# EAGLE schematic MicroBoardMk1 (EAGLE 7.2.0)

## Sheet 1 of 4
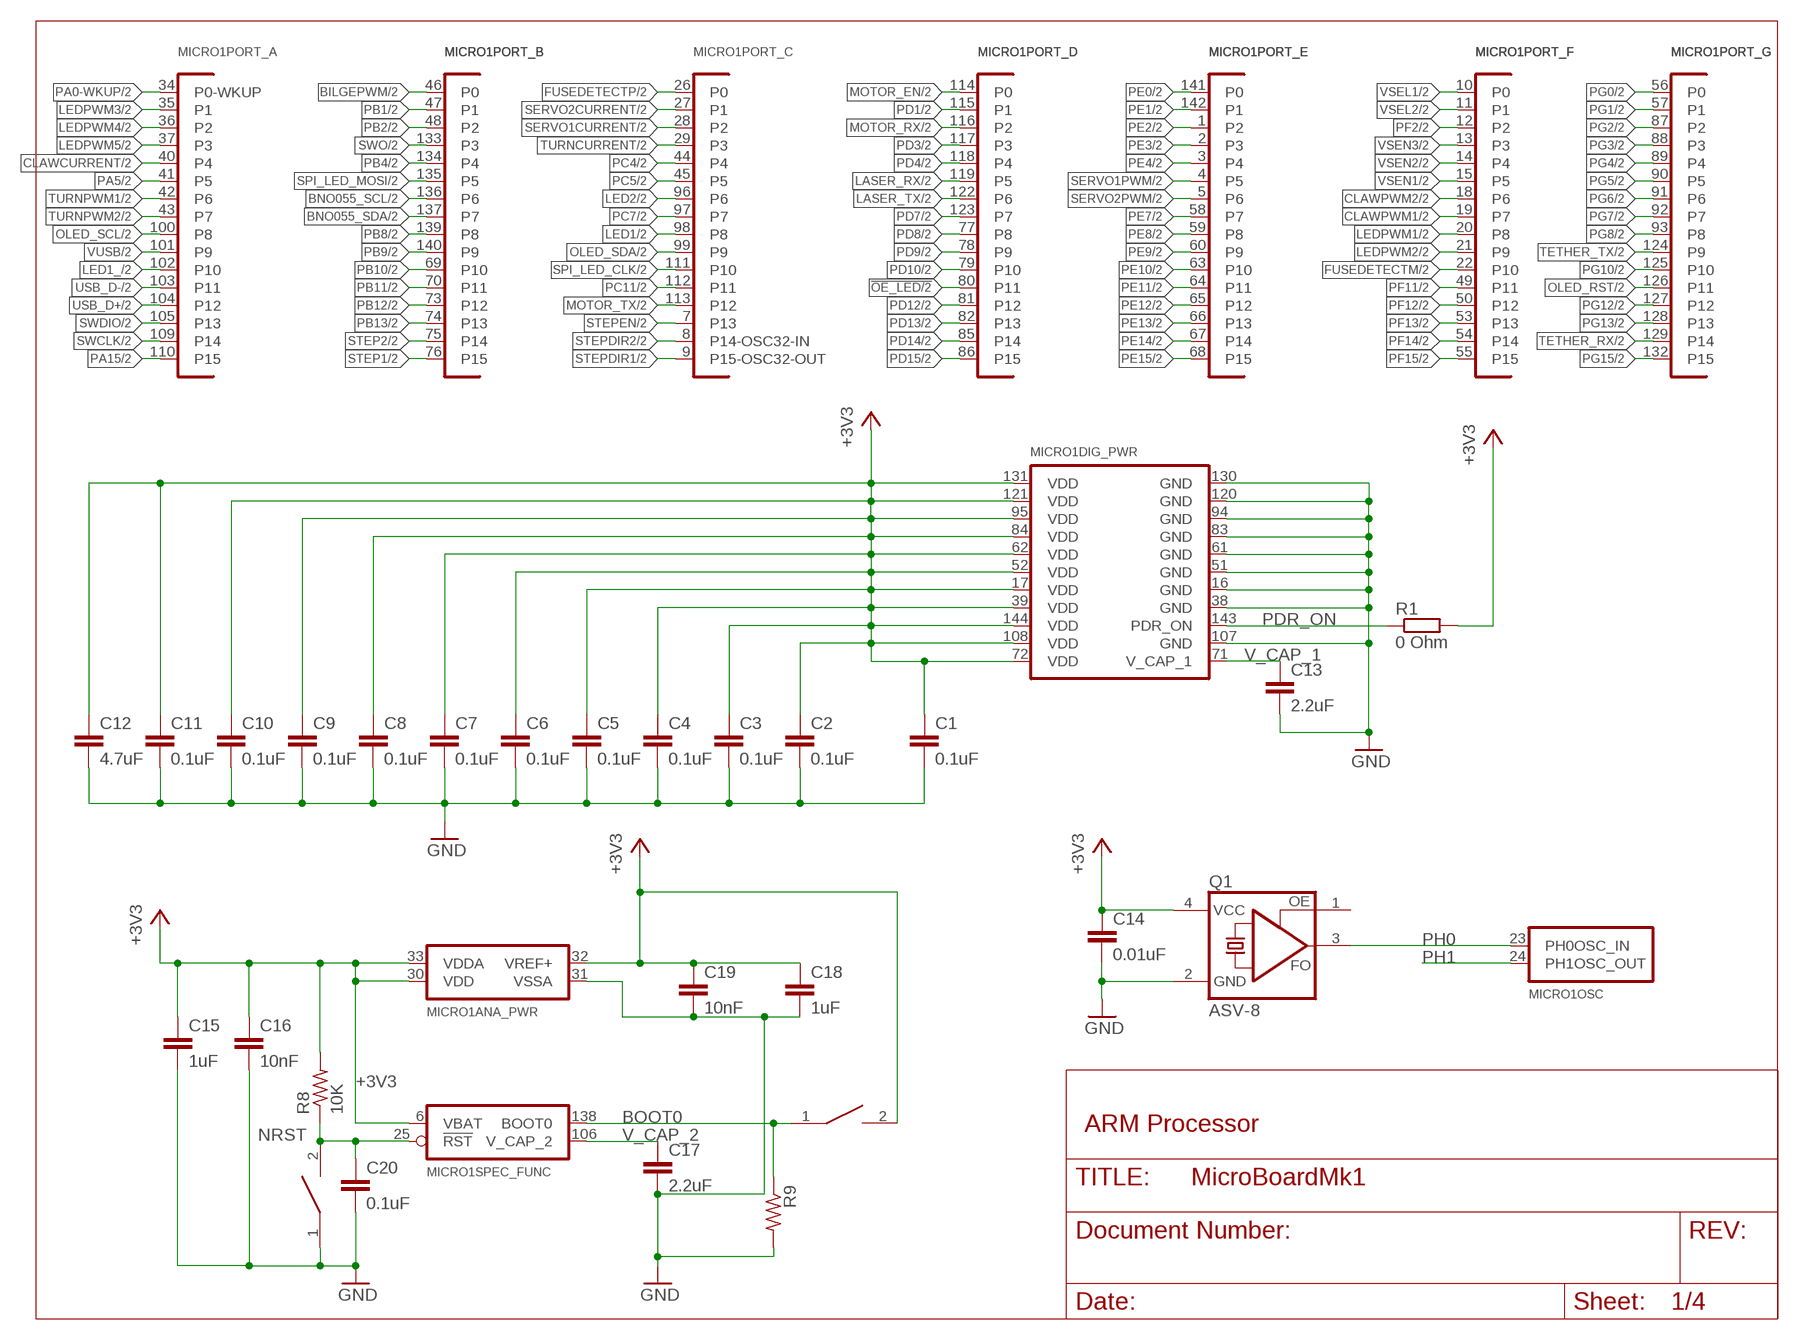
[diagram p0: schematic, sheet 1]

### Parts
BOOT_SW  SWITCH  [SW_2512]
C1  0.1uF  C-EUC0603  [C0603]
C2  0.1uF  C-EUC0603  [C0603]
C3  0.1uF  C-EUC0603  [C0603]
C4  0.1uF  C-EUC0603  [C0603]
C5  0.1uF  C-EUC0603  [C0603]
C6  0.1uF  C-EUC0603  [C0603]
C7  0.1uF  C-EUC0603  [C0603]
C8  0.1uF  C-EUC0603  [C0603]
C9  0.1uF  C-EUC0603  [C0603]
C10  0.1uF  C-EUC0603  [C0603]
C11  0.1uF  C-EUC0603  [C0603]
C12  4.7uF  C-EUC0603  [C0603]
C13  2.2uF  C-EUC0603  [C0603]
C14  0.01uF  C-EUC0603  [C0603]
C15  1uF  C-EUC0603  [C0603]
C16  10nF  C-EUC0603  [C0603]
C17  2.2uF  C-EUC0603  [C0603]
C18  1uF  C-EUC0603  [C0603]
C19  10nF  C-EUC0603  [C0603]
C20  0.1uF  C-EUC0603  [C0603]
MICRO1  STM32F407ZET6  [SQFP-S-20X20-144]
Q1  ASV-8  ASF  [ASF]
R1  0 Ohm  R-EU_R0603  [R0603]
R8  10K  R-US_R0603  [R0603]
R9  R-US_R0603  [R0603]
RST_SW  SWITCH  [SW_2512]

### Nets
!OE_LED: MICRO1.80(PORT_D:P11) ; also sheet 2,4
+3V3: BOOT_SW.2 C1.1 C2.1 C3.1 C4.1 C5.1 C6.1 C7.1 C8.1 C9.1 C10.1 C11.1 C12.1 C14.1 C15.1 C16.1 C18.1 C19.1 MICRO1.6(SPEC_FUNC:VBAT) MICRO1.17(DIG_PWR:VDD) MICRO1.30(ANA_PWR:VDD) MICRO1.32(ANA_PWR:VREF+) MICRO1.33(ANA_PWR:VDDA) MICRO1.39(DIG_PWR:VDD) MICRO1.52(DIG_PWR:VDD) MICRO1.62(DIG_PWR:VDD) MICRO1.72(DIG_PWR:VDD) MICRO1.84(DIG_PWR:VDD) MICRO1.95(DIG_PWR:VDD) MICRO1.108(DIG_PWR:VDD) MICRO1.121(DIG_PWR:VDD) MICRO1.131(DIG_PWR:VDD) MICRO1.144(DIG_PWR:VDD) Q1.4(VCC) R1.2 R8.2 ; also sheet 2,3,4
BILGEPWM: MICRO1.46(PORT_B:P0) ; also sheet 2
BNO055_SCL: MICRO1.136(PORT_B:P6) ; also sheet 2,3
BNO055_SDA: MICRO1.137(PORT_B:P7) ; also sheet 2,3
BOOT0: BOOT_SW.1 MICRO1.138(SPEC_FUNC:BOOT0) R9.1 ; also sheet 2
CLAWCURRENT: MICRO1.40(PORT_A:P4) ; also sheet 2
CLAWPWM1: MICRO1.19(PORT_F:P7) ; also sheet 2
CLAWPWM2: MICRO1.18(PORT_F:P6) ; also sheet 2
FUSEDETECTM: MICRO1.22(PORT_F:P10) ; also sheet 2
FUSEDETECTP: MICRO1.26(PORT_C:P0) ; also sheet 2
GND: C1.2 C2.2 C3.2 C4.2 C5.2 C6.2 C7.2 C8.2 C9.2 C10.2 C11.2 C12.2 C13.2 C14.2 C15.2 C16.2 C17.2 C18.2 C19.2 C20.2 MICRO1.16(DIG_PWR:GND) MICRO1.31(ANA_PWR:VSSA) MICRO1.38(DIG_PWR:GND) MICRO1.51(DIG_PWR:GND) MICRO1.61(DIG_PWR:GND) MICRO1.83(DIG_PWR:GND) MICRO1.94(DIG_PWR:GND) MICRO1.107(DIG_PWR:GND) MICRO1.120(DIG_PWR:GND) MICRO1.130(DIG_PWR:GND) Q1.2(GND) R9.2 RST_SW.1 ; also sheet 2,3,4
LASER_RX: MICRO1.119(PORT_D:P5) ; also sheet 2
LASER_TX: MICRO1.122(PORT_D:P6) ; also sheet 2
LED1: MICRO1.98(PORT_C:P8) ; also sheet 2,4
LED1_: MICRO1.102(PORT_A:P10) ; also sheet 2
LED2: MICRO1.96(PORT_C:P6) ; also sheet 2,4
LEDPWM1: MICRO1.20(PORT_F:P8) ; also sheet 2
LEDPWM2: MICRO1.21(PORT_F:P9) ; also sheet 2
LEDPWM3: MICRO1.35(PORT_A:P1) ; also sheet 2
LEDPWM4: MICRO1.36(PORT_A:P2) ; also sheet 2
LEDPWM5: MICRO1.37(PORT_A:P3) ; also sheet 2
MOTOR_EN: MICRO1.114(PORT_D:P0) ; also sheet 2,4
MOTOR_RX: MICRO1.116(PORT_D:P2) ; also sheet 2,4
MOTOR_TX: MICRO1.113(PORT_C:P12) ; also sheet 2,4
NRST: C20.1 MICRO1.25(SPEC_FUNC:!RST) R8.1 RST_SW.2 ; also sheet 2
OLED_RST: MICRO1.126(PORT_G:P11) ; also sheet 2
OLED_SCL: MICRO1.100(PORT_A:P8) ; also sheet 2
OLED_SDA: MICRO1.99(PORT_C:P9) ; also sheet 2
PA0-WKUP: MICRO1.34(PORT_A:P0-WKUP) ; also sheet 2
PA5: MICRO1.41(PORT_A:P5) ; also sheet 2
PA15: MICRO1.110(PORT_A:P15) ; also sheet 2
PB1: MICRO1.47(PORT_B:P1) ; also sheet 2
PB2: MICRO1.48(PORT_B:P2) ; also sheet 2
PB4: MICRO1.134(PORT_B:P4) ; also sheet 2
PB8: MICRO1.139(PORT_B:P8) ; also sheet 2
PB9: MICRO1.140(PORT_B:P9) ; also sheet 2
PB10: MICRO1.69(PORT_B:P10) ; also sheet 2
PB11: MICRO1.70(PORT_B:P11) ; also sheet 2
PB12: MICRO1.73(PORT_B:P12) ; also sheet 2
PB13: MICRO1.74(PORT_B:P13) ; also sheet 2
PC4: MICRO1.44(PORT_C:P4) ; also sheet 2
PC5: MICRO1.45(PORT_C:P5) ; also sheet 2
PC7: MICRO1.97(PORT_C:P7) ; also sheet 2
PC11: MICRO1.112(PORT_C:P11) ; also sheet 2
PD1: MICRO1.115(PORT_D:P1) ; also sheet 2
PD3: MICRO1.117(PORT_D:P3) ; also sheet 2
PD4: MICRO1.118(PORT_D:P4) ; also sheet 2
PD7: MICRO1.123(PORT_D:P7) ; also sheet 2
PD8: MICRO1.77(PORT_D:P8) ; also sheet 2
PD9: MICRO1.78(PORT_D:P9) ; also sheet 2
PD10: MICRO1.79(PORT_D:P10) ; also sheet 2
PD12: MICRO1.81(PORT_D:P12) ; also sheet 2
PD13: MICRO1.82(PORT_D:P13) ; also sheet 2
PD14: MICRO1.85(PORT_D:P14) ; also sheet 2
PD15: MICRO1.86(PORT_D:P15) ; also sheet 2
PDR_ON: MICRO1.143(DIG_PWR:PDR_ON) R1.1 ; also sheet 2
PE0: MICRO1.141(PORT_E:P0) ; also sheet 2
PE1: MICRO1.142(PORT_E:P1) ; also sheet 2
PE2: MICRO1.1(PORT_E:P2) ; also sheet 2
PE3: MICRO1.2(PORT_E:P3) ; also sheet 2
PE4: MICRO1.3(PORT_E:P4) ; also sheet 2
PE7: MICRO1.58(PORT_E:P7) ; also sheet 2
PE8: MICRO1.59(PORT_E:P8) ; also sheet 2
PE9: MICRO1.60(PORT_E:P9) ; also sheet 2
PE10: MICRO1.63(PORT_E:P10) ; also sheet 2
PE11: MICRO1.64(PORT_E:P11) ; also sheet 2
PE12: MICRO1.65(PORT_E:P12) ; also sheet 2
PE13: MICRO1.66(PORT_E:P13) ; also sheet 2
PE14: MICRO1.67(PORT_E:P14) ; also sheet 2
PE15: MICRO1.68(PORT_E:P15) ; also sheet 2
PF2: MICRO1.12(PORT_F:P2) ; also sheet 2
PF11: MICRO1.49(PORT_F:P11) ; also sheet 2
PF12: MICRO1.50(PORT_F:P12) ; also sheet 2
PF13: MICRO1.53(PORT_F:P13) ; also sheet 2
PF14: MICRO1.54(PORT_F:P14) ; also sheet 2
PF15: MICRO1.55(PORT_F:P15) ; also sheet 2
PG0: MICRO1.56(PORT_G:P0) ; also sheet 2
PG1: MICRO1.57(PORT_G:P1) ; also sheet 2
PG2: MICRO1.87(PORT_G:P2) ; also sheet 2
PG3: MICRO1.88(PORT_G:P3) ; also sheet 2
PG4: MICRO1.89(PORT_G:P4) ; also sheet 2
PG5: MICRO1.90(PORT_G:P5) ; also sheet 2
PG6: MICRO1.91(PORT_G:P6) ; also sheet 2
PG7: MICRO1.92(PORT_G:P7) ; also sheet 2
PG8: MICRO1.93(PORT_G:P8) ; also sheet 2
PG10: MICRO1.125(PORT_G:P10) ; also sheet 2
PG12: MICRO1.127(PORT_G:P12) ; also sheet 2
PG13: MICRO1.128(PORT_G:P13) ; also sheet 2
PG15: MICRO1.132(PORT_G:P15) ; also sheet 2
PH0: MICRO1.23(OSC:PH0OSC_IN) Q1.3(FO) ; also sheet 2
PH1: MICRO1.24(OSC:PH1OSC_OUT) ; also sheet 2
SERVO1CURRENT: MICRO1.28(PORT_C:P2) ; also sheet 2
SERVO1PWM: MICRO1.4(PORT_E:P5) ; also sheet 2
SERVO2CURRENT: MICRO1.27(PORT_C:P1) ; also sheet 2
SERVO2PWM: MICRO1.5(PORT_E:P6) ; also sheet 2
SPI_LED_CLK: MICRO1.111(PORT_C:P10) ; also sheet 2,4
SPI_LED_MOSI: MICRO1.135(PORT_B:P5) ; also sheet 2,4
STEP1: MICRO1.76(PORT_B:P15) ; also sheet 2
STEP2: MICRO1.75(PORT_B:P14) ; also sheet 2
STEPDIR1: MICRO1.9(PORT_C:P15-OSC32-OUT) ; also sheet 2
STEPDIR2: MICRO1.8(PORT_C:P14-OSC32-IN) ; also sheet 2
STEPEN: MICRO1.7(PORT_C:P13) ; also sheet 2
SWCLK: MICRO1.109(PORT_A:P14) ; also sheet 2
SWDIO: MICRO1.105(PORT_A:P13) ; also sheet 2
SWO: MICRO1.133(PORT_B:P3) ; also sheet 2
TETHER_RX: MICRO1.129(PORT_G:P14) ; also sheet 2
TETHER_TX: MICRO1.124(PORT_G:P9) ; also sheet 2
TURNCURRENT: MICRO1.29(PORT_C:P3) ; also sheet 2
TURNPWM1: MICRO1.42(PORT_A:P6) ; also sheet 2
TURNPWM2: MICRO1.43(PORT_A:P7) ; also sheet 2
USB_D+: MICRO1.104(PORT_A:P12) ; also sheet 2,3
USB_D-: MICRO1.103(PORT_A:P11) ; also sheet 2,3
V_CAP_1: C13.1 MICRO1.71(DIG_PWR:V_CAP_1) ; also sheet 2
V_CAP_2: C17.1 MICRO1.106(SPEC_FUNC:V_CAP_2) ; also sheet 2
VSEL1: MICRO1.10(PORT_F:P0) ; also sheet 2
VSEL2: MICRO1.11(PORT_F:P1) ; also sheet 2
VSEN1: MICRO1.15(PORT_F:P5) ; also sheet 2
VSEN2: MICRO1.14(PORT_F:P4) ; also sheet 2
VSEN3: MICRO1.13(PORT_F:P3) ; also sheet 2
VUSB: MICRO1.101(PORT_A:P9) ; also sheet 2,3
Unconnected: Q1.1(OE)

### Notes on the sheet
- ARM Processor

## Sheet 2 of 4
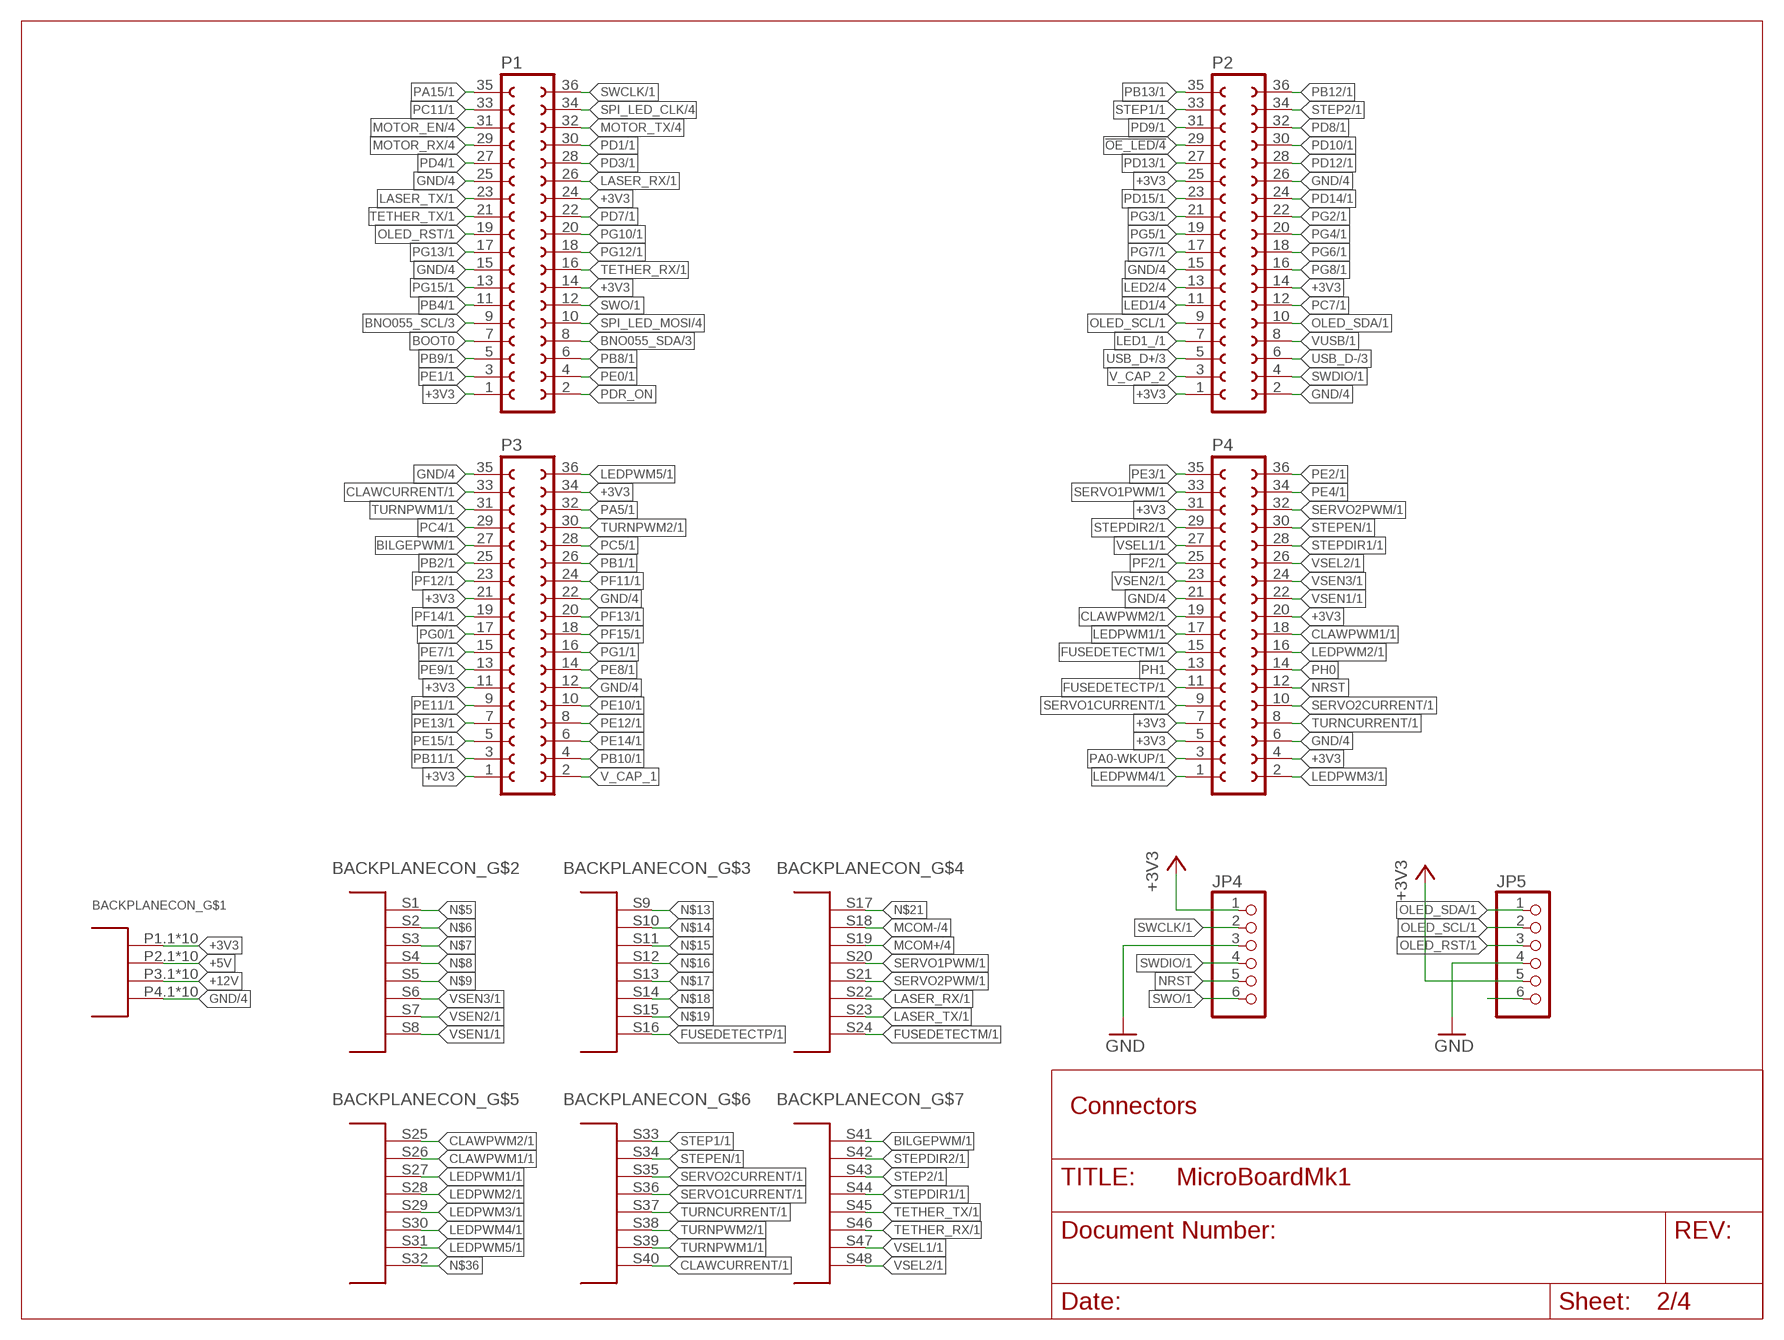
[diagram p1: schematic, sheet 2]

### Parts
BACKPLANECON_  TEN60-S24-S24-P4-RA  [TEN60-S24-S24-P4-RA]
JP4  PINHD-1X6  [1X06]
JP5  PINHD-1X6  [1X06]
P1  FE18-2  [FE18-2]
P2  FE18-2  [FE18-2]
P3  FE18-2  [FE18-2]
P4  FE18-2  [FE18-2]

### Nets
!OE_LED: P2.29 ; also sheet 1,4
+3V3: BACKPLANECON_.P1.1 BACKPLANECON_.P1.2 BACKPLANECON_.P1.3 BACKPLANECON_.P1.4 BACKPLANECON_.P1.5 BACKPLANECON_.P1.6 BACKPLANECON_.P1.7 BACKPLANECON_.P1.8 BACKPLANECON_.P1.9 BACKPLANECON_.P1.10 JP4.1 JP5.5 P1.1 P1.14 P1.24 P2.1 P2.14 P2.25 P3.1 P3.11 P3.21 P3.34 P4.4 P4.5 P4.7 P4.20 P4.31 ; also sheet 1,3,4
+5V: BACKPLANECON_.P2.1 BACKPLANECON_.P2.2 BACKPLANECON_.P2.3 BACKPLANECON_.P2.4 BACKPLANECON_.P2.5 BACKPLANECON_.P2.6 BACKPLANECON_.P2.7 BACKPLANECON_.P2.8 BACKPLANECON_.P2.9 BACKPLANECON_.P2.10 ; also sheet 3
+12V: BACKPLANECON_.P3.1 BACKPLANECON_.P3.2 BACKPLANECON_.P3.3 BACKPLANECON_.P3.4 BACKPLANECON_.P3.5 BACKPLANECON_.P3.6 BACKPLANECON_.P3.7 BACKPLANECON_.P3.8 BACKPLANECON_.P3.9 BACKPLANECON_.P3.10
BILGEPWM: BACKPLANECON_.S41 P3.27 ; also sheet 1
BNO055_SCL: P1.9 ; also sheet 1,3
BNO055_SDA: P1.8 ; also sheet 1,3
BOOT0: P1.7 ; also sheet 1
CLAWCURRENT: BACKPLANECON_.S40 P3.33 ; also sheet 1
CLAWPWM1: BACKPLANECON_.S26 P4.18 ; also sheet 1
CLAWPWM2: BACKPLANECON_.S25 P4.19 ; also sheet 1
FUSEDETECTM: BACKPLANECON_.S24 P4.15 ; also sheet 1
FUSEDETECTP: BACKPLANECON_.S16 P4.11 ; also sheet 1
GND: BACKPLANECON_.P4.1 BACKPLANECON_.P4.2 BACKPLANECON_.P4.3 BACKPLANECON_.P4.4 BACKPLANECON_.P4.5 BACKPLANECON_.P4.6 BACKPLANECON_.P4.7 BACKPLANECON_.P4.8 BACKPLANECON_.P4.9 BACKPLANECON_.P4.10 JP4.3 JP5.4 P1.15 P1.25 P2.2 P2.15 P2.26 P3.12 P3.22 P3.35 P4.6 P4.21 ; also sheet 1,3,4
LASER_RX: BACKPLANECON_.S22 P1.26 ; also sheet 1
LASER_TX: BACKPLANECON_.S23 P1.23 ; also sheet 1
LED1: P2.11 ; also sheet 1,4
LED1_: P2.7 ; also sheet 1
LED2: P2.13 ; also sheet 1,4
LEDPWM1: BACKPLANECON_.S27 P4.17 ; also sheet 1
LEDPWM2: BACKPLANECON_.S28 P4.16 ; also sheet 1
LEDPWM3: BACKPLANECON_.S29 P4.2 ; also sheet 1
LEDPWM4: BACKPLANECON_.S30 P4.1 ; also sheet 1
LEDPWM5: BACKPLANECON_.S31 P3.36 ; also sheet 1
MCOM+: BACKPLANECON_.S19 ; also sheet 4
MCOM-: BACKPLANECON_.S18 ; also sheet 4
MOTOR_EN: P1.31 ; also sheet 1,4
MOTOR_RX: P1.29 ; also sheet 1,4
MOTOR_TX: P1.32 ; also sheet 1,4
N$5: BACKPLANECON_.S1
N$6: BACKPLANECON_.S2
N$7: BACKPLANECON_.S3
N$8: BACKPLANECON_.S4
N$9: BACKPLANECON_.S5
N$13: BACKPLANECON_.S9
N$14: BACKPLANECON_.S10
N$15: BACKPLANECON_.S11
N$16: BACKPLANECON_.S12
N$17: BACKPLANECON_.S13
N$18: BACKPLANECON_.S14
N$19: BACKPLANECON_.S15
N$21: BACKPLANECON_.S17
N$32: JP5.6
N$36: BACKPLANECON_.S32
NRST: JP4.5 P4.12 ; also sheet 1
OLED_RST: JP5.3 P1.19 ; also sheet 1
OLED_SCL: JP5.2 P2.9 ; also sheet 1
OLED_SDA: JP5.1 P2.10 ; also sheet 1
PA0-WKUP: P4.3 ; also sheet 1
PA5: P3.32 ; also sheet 1
PA15: P1.35 ; also sheet 1
PB1: P3.26 ; also sheet 1
PB2: P3.25 ; also sheet 1
PB4: P1.11 ; also sheet 1
PB8: P1.6 ; also sheet 1
PB9: P1.5 ; also sheet 1
PB10: P3.4 ; also sheet 1
PB11: P3.3 ; also sheet 1
PB12: P2.36 ; also sheet 1
PB13: P2.35 ; also sheet 1
PC4: P3.29 ; also sheet 1
PC5: P3.28 ; also sheet 1
PC7: P2.12 ; also sheet 1
PC11: P1.33 ; also sheet 1
PD1: P1.30 ; also sheet 1
PD3: P1.28 ; also sheet 1
PD4: P1.27 ; also sheet 1
PD7: P1.22 ; also sheet 1
PD8: P2.32 ; also sheet 1
PD9: P2.31 ; also sheet 1
PD10: P2.30 ; also sheet 1
PD12: P2.28 ; also sheet 1
PD13: P2.27 ; also sheet 1
PD14: P2.24 ; also sheet 1
PD15: P2.23 ; also sheet 1
PDR_ON: P1.2 ; also sheet 1
PE0: P1.4 ; also sheet 1
PE1: P1.3 ; also sheet 1
PE2: P4.36 ; also sheet 1
PE3: P4.35 ; also sheet 1
PE4: P4.34 ; also sheet 1
PE7: P3.15 ; also sheet 1
PE8: P3.14 ; also sheet 1
PE9: P3.13 ; also sheet 1
PE10: P3.10 ; also sheet 1
PE11: P3.9 ; also sheet 1
PE12: P3.8 ; also sheet 1
PE13: P3.7 ; also sheet 1
PE14: P3.6 ; also sheet 1
PE15: P3.5 ; also sheet 1
PF2: P4.25 ; also sheet 1
PF11: P3.24 ; also sheet 1
PF12: P3.23 ; also sheet 1
PF13: P3.20 ; also sheet 1
PF14: P3.19 ; also sheet 1
PF15: P3.18 ; also sheet 1
PG0: P3.17 ; also sheet 1
PG1: P3.16 ; also sheet 1
PG2: P2.22 ; also sheet 1
PG3: P2.21 ; also sheet 1
PG4: P2.20 ; also sheet 1
PG5: P2.19 ; also sheet 1
PG6: P2.18 ; also sheet 1
PG7: P2.17 ; also sheet 1
PG8: P2.16 ; also sheet 1
PG10: P1.20 ; also sheet 1
PG12: P1.18 ; also sheet 1
PG13: P1.17 ; also sheet 1
PG15: P1.13 ; also sheet 1
PH0: P4.14 ; also sheet 1
PH1: P4.13 ; also sheet 1
SERVO1CURRENT: BACKPLANECON_.S36 P4.9 ; also sheet 1
SERVO1PWM: BACKPLANECON_.S20 P4.33 ; also sheet 1
SERVO2CURRENT: BACKPLANECON_.S35 P4.10 ; also sheet 1
SERVO2PWM: BACKPLANECON_.S21 P4.32 ; also sheet 1
SPI_LED_CLK: P1.34 ; also sheet 1,4
SPI_LED_MOSI: P1.10 ; also sheet 1,4
STEP1: BACKPLANECON_.S33 P2.33 ; also sheet 1
STEP2: BACKPLANECON_.S43 P2.34 ; also sheet 1
STEPDIR1: BACKPLANECON_.S44 P4.28 ; also sheet 1
STEPDIR2: BACKPLANECON_.S42 P4.29 ; also sheet 1
STEPEN: BACKPLANECON_.S34 P4.30 ; also sheet 1
SWCLK: JP4.2 P1.36 ; also sheet 1
SWDIO: JP4.4 P2.4 ; also sheet 1
SWO: JP4.6 P1.12 ; also sheet 1
TETHER_RX: BACKPLANECON_.S46 P1.16 ; also sheet 1
TETHER_TX: BACKPLANECON_.S45 P1.21 ; also sheet 1
TURNCURRENT: BACKPLANECON_.S37 P4.8 ; also sheet 1
TURNPWM1: BACKPLANECON_.S39 P3.31 ; also sheet 1
TURNPWM2: BACKPLANECON_.S38 P3.30 ; also sheet 1
USB_D+: P2.5 ; also sheet 1,3
USB_D-: P2.6 ; also sheet 1,3
V_CAP_1: P3.2 ; also sheet 1
V_CAP_2: P2.3 ; also sheet 1
VSEL1: BACKPLANECON_.S47 P4.27 ; also sheet 1
VSEL2: BACKPLANECON_.S48 P4.26 ; also sheet 1
VSEN1: BACKPLANECON_.S8 P4.22 ; also sheet 1
VSEN2: BACKPLANECON_.S7 P4.23 ; also sheet 1
VSEN3: BACKPLANECON_.S6 P4.24 ; also sheet 1
VUSB: P2.8 ; also sheet 1,3

### Notes on the sheet
- Connectors

## Sheet 3 of 4
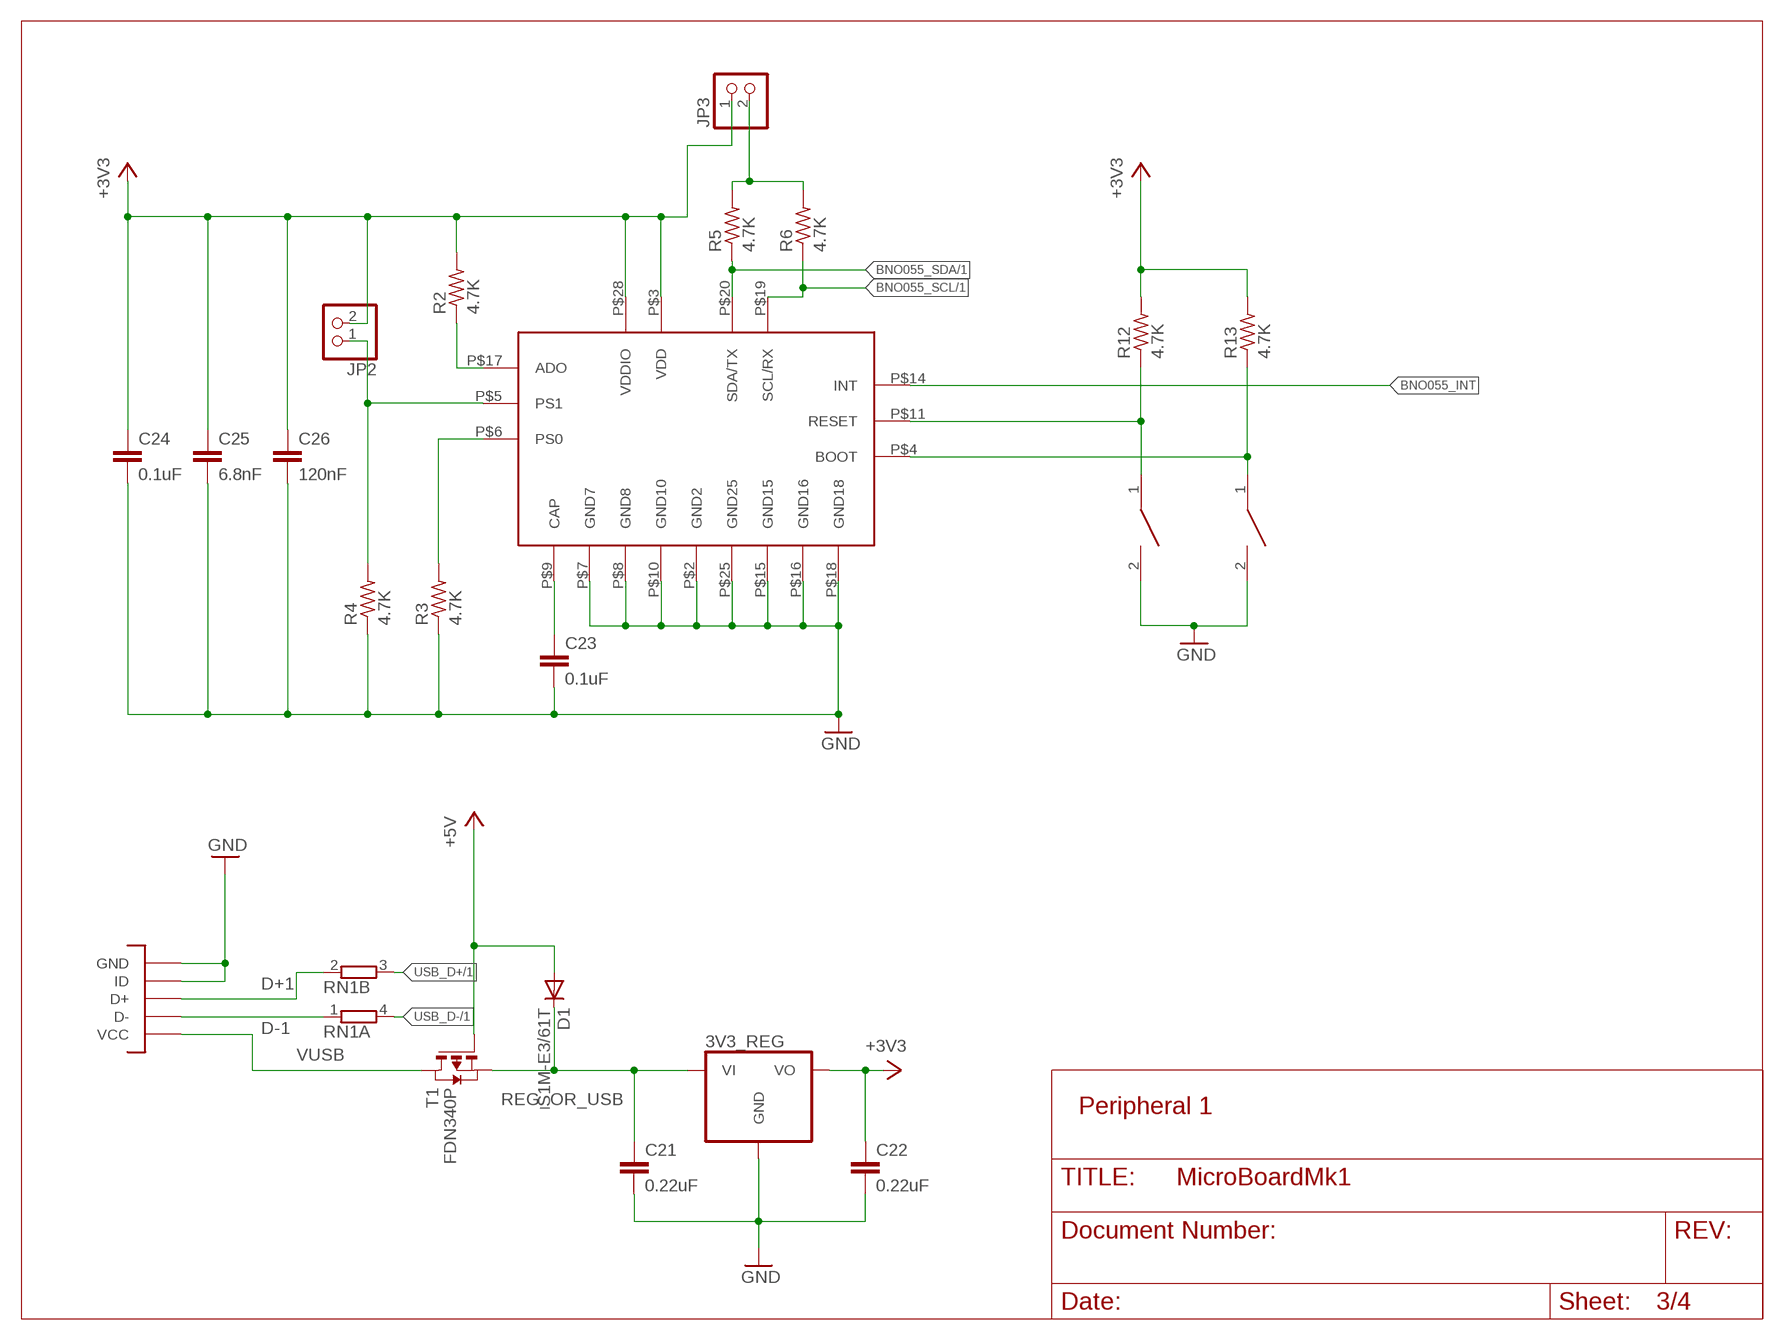
[diagram p2: schematic, sheet 3]

### Parts
3V3_REG  AP1117-3.3SOT223  [SOT223]
BNO055  BNO055  [LGA28]
BNO_BOOT_SW  SWITCH  [SW_2512]
BNO_RST_SW  SWITCH  [SW_2512]
C21  0.22uF  C-EUC0603  [C0603]
C22  0.22uF  C-EUC0603  [C0603]
C23  0.1uF  C-EUC0603  [C0603]
C24  0.1uF  C-EUC0603  [C0603]
C25  6.8nF  C-EUC0603  [C0603]
C26  120nF  C-EUC0603  [C0603]
D1  S1M-E3/61T  DIODE-DO-214AC  [DO-214AC]
JP1  MICROUSB  [MICRO_B]
JP2  PINHD-1X2  [1X02]
JP3  PINHD-1X2  [1X02]
R2  4.7K  R-US_R0603  [R0603]
R3  4.7K  R-US_R0603  [R0603]
R4  4.7K  R-US_R0603  [R0603]
R5  4.7K  R-US_R0603  [R0603]
R6  4.7K  R-US_R0603  [R0603]
R12  4.7K  R-US_R0603  [R0603]
R13  4.7K  R-US_R0603  [R0603]
RN1  2R-NEXBV4V  [EXBV4V]
T1  FDN340P  [SOT-23]

### Nets
+3V3: 3V3_REG.2(VO) 3V3_REG.4(VO) BNO055.P$3(VDD) BNO055.P$28(VDDIO) C22.1 C24.1 C25.1 C26.1 JP2.2 JP3.1 R2.2 R12.2 R13.2 ; also sheet 1,2,4
+5V: D1.A T1.3(G) ; also sheet 2
BNO055_INT: BNO055.P$14(INT)
BNO055_SCL: BNO055.P$19(SCL/RX) R6.1 ; also sheet 1,2
BNO055_SDA: BNO055.P$20(SDA/TX) R5.1 ; also sheet 1,2
D+1: JP1.P3(D+) RN1.2
D-1: JP1.P2(D-) RN1.1
GND: 3V3_REG.1(GND) BNO055.P$2(GND2) BNO055.P$7(GND7) BNO055.P$8(GND8) BNO055.P$10(GND10) BNO055.P$15(GND15) BNO055.P$16(GND16) BNO055.P$18(GND18) BNO055.P$25(GND25) BNO_BOOT_SW.2 BNO_RST_SW.2 C21.2 C22.2 C23.2 C24.2 C25.2 C26.2 JP1.GND1(GND) JP1.GND2(GND) JP1.GND3(GND) JP1.GND4(GND) JP1.GND7(GND) JP1.GND8(GND) JP1.P4(ID) JP1.P5(GND) R3.1 R4.1 ; also sheet 1,2,4
N$10: BNO055.P$9(CAP) C23.1
N$11: BNO055.P$17(ADO) R2.1
N$12: BNO055.P$5(PS1) JP2.1 R4.2
N$20: BNO055.P$6(PS0) R3.2
N$22: JP3.2 R5.2 R6.2
N$26: BNO055.P$4(BOOT) BNO_BOOT_SW.1 R13.1
N$27: BNO055.P$11(RESET) BNO_RST_SW.1 R12.1
REG_OR_USB: 3V3_REG.3(VI) C21.1 D1.C T1.2(S)
USB_D+: RN1.3 ; also sheet 1,2
USB_D-: RN1.4 ; also sheet 1,2
VUSB: JP1.P1(VCC) T1.1(D) ; also sheet 1,2

### Notes on the sheet
- Peripheral 1

## Sheet 4 of 4
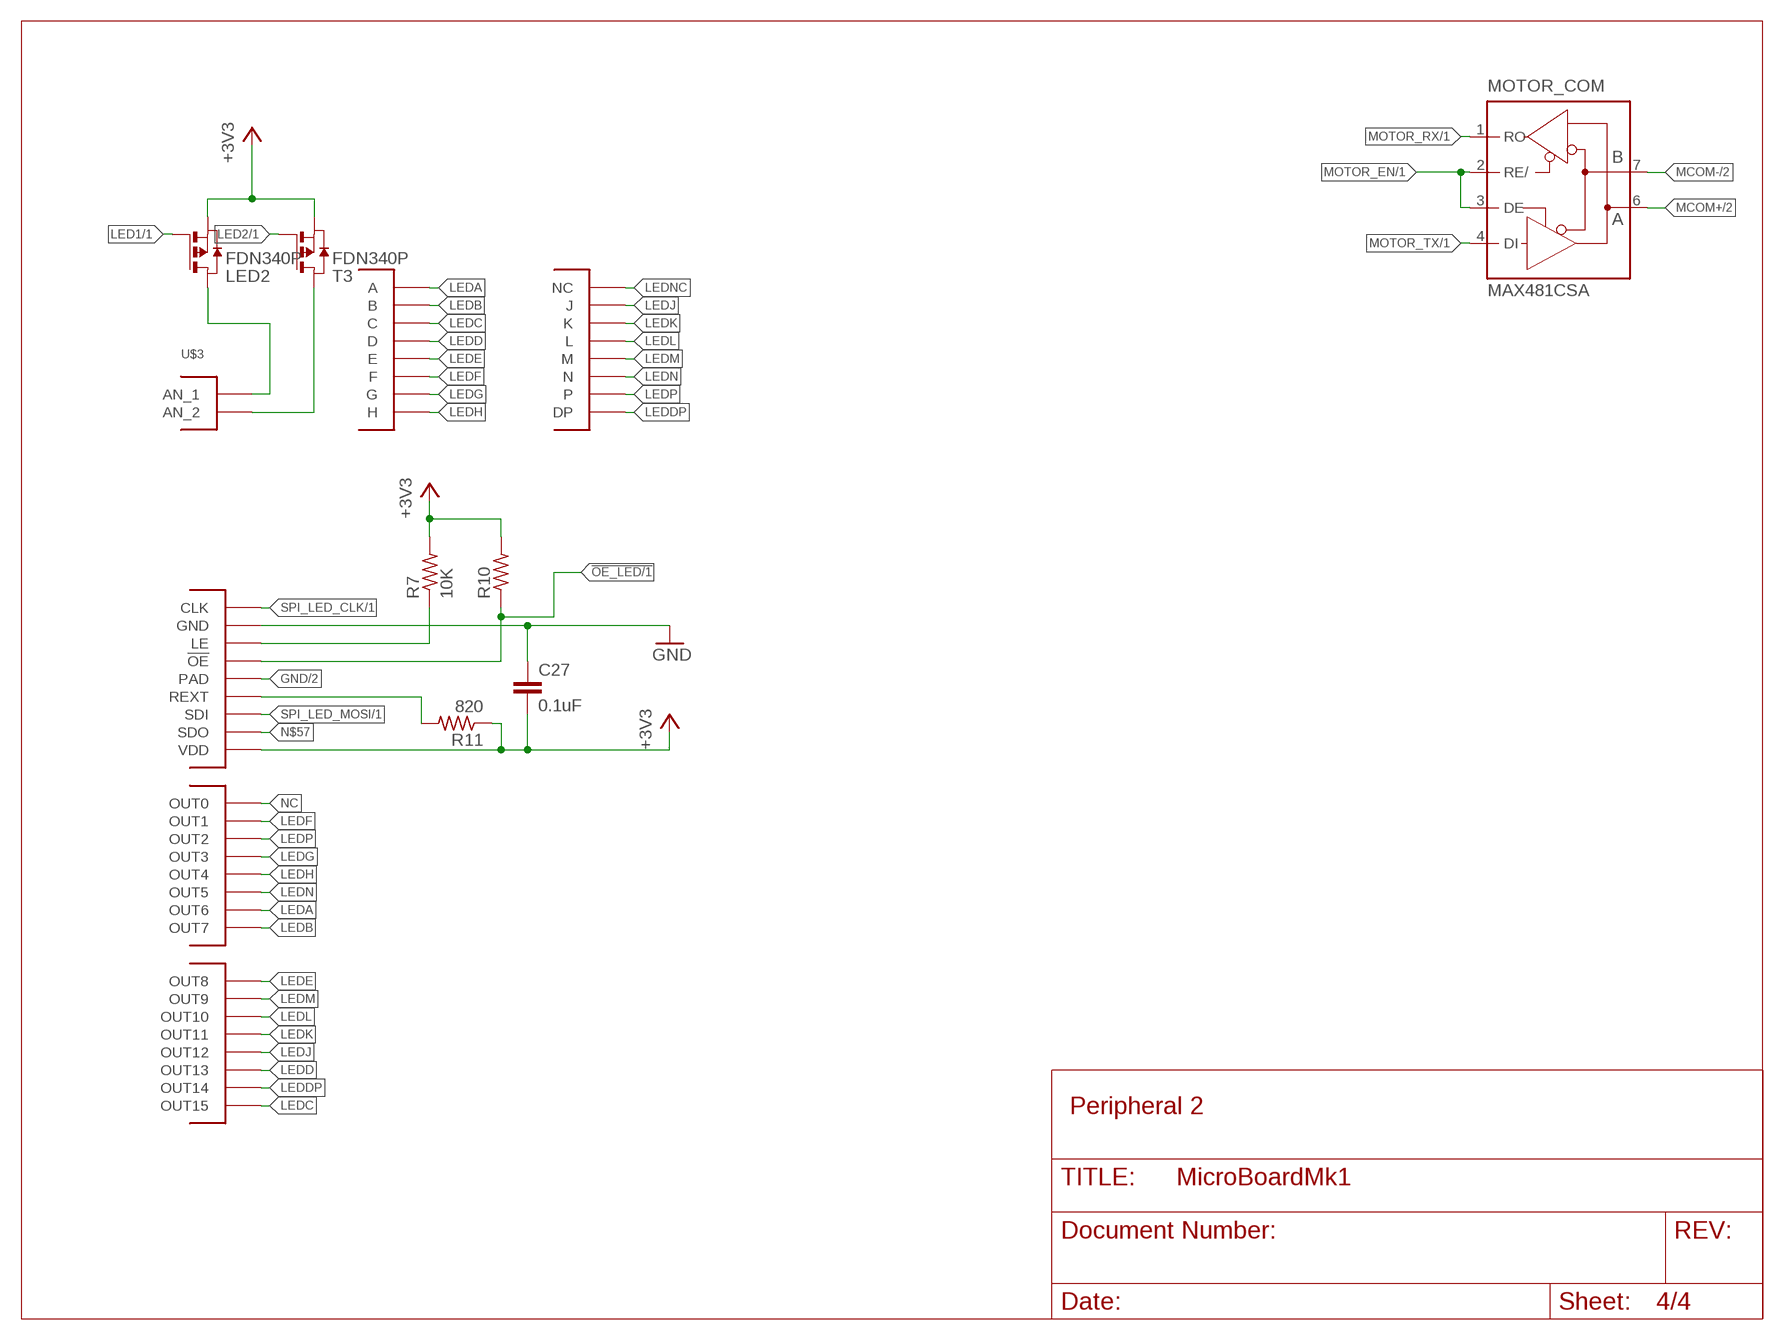
[diagram p3: schematic, sheet 4]

### Parts
A6282  A6282  [TSSOP24]
C27  0.1uF  C-EUC0603  [C0603]
LED2  FDN340P  [SOT-23]
MOTOR_COM  MAX481CSA  [SO08]
R7  10K  R-US_R0603  [R0603]
R10  R-US_R0603  [R0603]
R11  820  R-US_R0603  [R0603]
T3  FDN340P  [SOT-23]
U$3  LEDDISP  [LEDDISP]

### Nets
!OE_LED: A6282.21(!OE) R10.1 ; also sheet 1,2
+3V3: A6282.24(VDD) C27.2 LED2.2(S) R7.2 R10.2 R11.1 T3.2(S) ; also sheet 1,2,3
GND: A6282.1(GND) A6282.PAD C27.1 ; also sheet 1,2,3
LED1: LED2.3(G) ; also sheet 1,2
LED2: T3.3(G) ; also sheet 1,2
LEDA: A6282.11(OUT6) U$3.P$12(A)
LEDB: A6282.12(OUT7) U$3.P$10(B)
LEDC: A6282.20(OUT15) U$3.P$9(C)
LEDD: A6282.18(OUT13) U$3.P$7(D)
LEDDP: A6282.19(OUT14) U$3.P$8(DP)
LEDE: A6282.13(OUT8) U$3.P$1(E)
LEDF: A6282.6(OUT1) U$3.P$18(F)
LEDG: A6282.8(OUT3) U$3.P$15(G)
LEDH: A6282.9(OUT4) U$3.P$14(H)
LEDJ: A6282.17(OUT12) U$3.P$6(J)
LEDK: A6282.16(OUT11) U$3.P$5(K)
LEDL: A6282.15(OUT10) U$3.P$4(L)
LEDM: A6282.14(OUT9) U$3.P$2(M)
LEDN: A6282.10(OUT5) U$3.P$13(N)
LEDNC: U$3.P$3(NC)
LEDP: A6282.7(OUT2) U$3.P$17(P)
MCOM+: MOTOR_COM.6(A) ; also sheet 2
MCOM-: MOTOR_COM.7(B) ; also sheet 2
MOTOR_EN: MOTOR_COM.2(RE/) MOTOR_COM.3(DE) ; also sheet 1,2
MOTOR_RX: MOTOR_COM.1(RO) ; also sheet 1,2
MOTOR_TX: MOTOR_COM.4(DI) ; also sheet 1,2
N$23: T3.1(D) U$3.P$11(AN_2)
N$48: LED2.1(D) U$3.P$16(AN_1)
N$52: A6282.4(LE) R7.1
N$55: A6282.23(REXT) R11.2
N$57: A6282.22(SDO)
NC: A6282.5(OUT0)
SPI_LED_CLK: A6282.3(CLK) ; also sheet 1,2
SPI_LED_MOSI: A6282.2(SDI) ; also sheet 1,2

### Notes on the sheet
- Peripheral 2

## Power pins joined to a net without a drawn wire
GND: MOTOR_COM.5(GND)
VCC: MOTOR_COM.8(VCC)

## Library data of the parts
3V3_REG = evan:AP1117-3.3: http://www.digikey.com/product-detail/en/AP1117IE33G-13/AP1117IE33G-13DICT-ND/3677984 800mA and 1A Low Dropout (LDO) Positive Regulator 1.8V, 2.5V, 2.85V, 3.3V, 5V, and Adj
A6282 = MicroBoard:A6282
BACKPLANECON_ = BackplaneConnector:TEN60-S24-S24-P4-RA
BNO055 = MicroBoard:BNO055
BNO_BOOT_SW BNO_RST_SW BOOT_SW RST_SW = MicroBoard:SWITCH
C1-C27 = resistor:C-EU: CAPACITOR, European symbol
D1 = diode:DIODE-: DIODE
JP1 = MicroBoard:MICROUSB
JP2 JP3 = pinhead:PINHD-1X2: PIN HEADER
JP4 JP5 = pinhead:PINHD-1X6: PIN HEADER
LED2 T1 T3 = MicroBoard:FDN340P: MOS FET; DIGIKEY: FDN340PCT-ND
MICRO1 = MicroBoard:STM32F407ZET6: 168 MHz, 192KB RAM, 512 KB Flash
MOTOR_COM = maxim:MAX481CSA: RS485 TRANSEIVER; MF: MAXIM; MPN: MAX481CSA; OC_FARNELL: unknown; OC_NEWARK: 90C3817
P1-P4 = con-lsta:FE18-2: FEMALE HEADER; OC_FARNELL: unknown; OC_NEWARK: unknown
Q1 = MicroBoard:ASF*: CRYSTAL CLOCK OSCILLATORS 5.0 Vdc or 3.3 Vdc - LOW PROFILE ULTRA MINIATURE CERAMIC SURFACE MOUNT Source: http://www.abracon.com/Oscillators/asf1-L-L1.pdf; DIGIKEY: 535-10066-1-ND
R1 = resistor:R-EU_: RESISTOR, European symbol
R2-R13 = resistor:R-US_: RESISTOR, American symbol
RN1 = MicroBoard:2R-N: Array Chip Resistor; DIGIKEY: RHM1381CT-ND; MF: Rohm Semiconductor; MPN: MNR12ERAPJ220
U$3 = MicroBoard:LEDDISP